# Altium project Tone Cushion.PrjPCB (part 3 of 3)
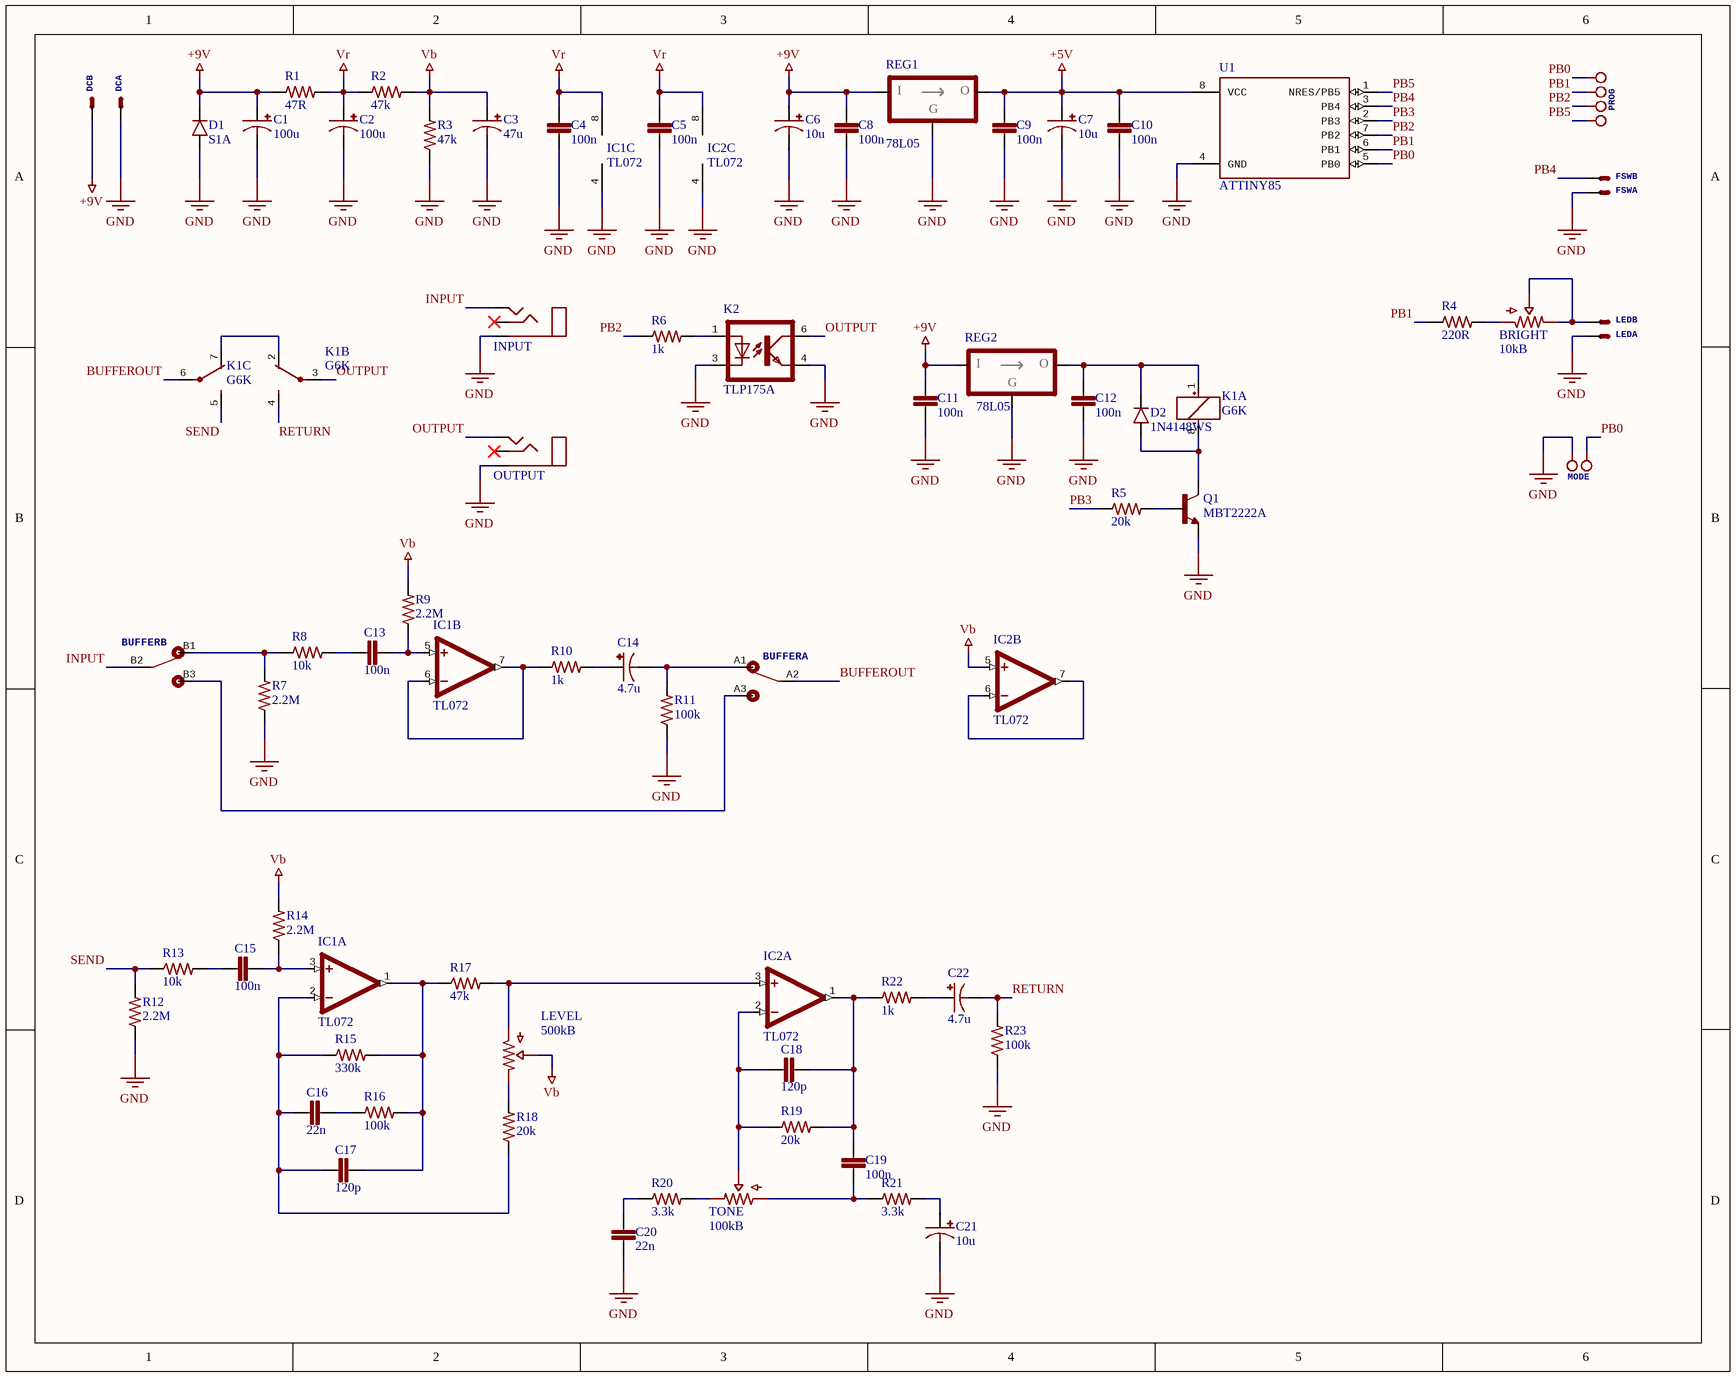
[diagram p2: Tone Cushion.SchDoc]

## Sheet Tone Cushion.SchDoc (continued)

### Library data of the parts (continued)
R7 R9 R12 R14 = CRCW06032M20FKEA: RES SMD 2.2M OHM 1% 1/10W 0603; Manufacturer: Vishay; Resistance: 2.2MR; Power Rating: 100mW; Temperature Coefficient: 100ppm/°C; Voltage Rating: 75V; Supplier 1: Farnell; Supplier Part Number 1: 2138646; Manufacturer Part Number: CRCW06032M20FKEA; Stock: 19125; Pricing: 10=0.0212, 100=0.0163, 500=0.0141, 1000=0.0073 (EUR); RoHS: Yes; Mount: Surface Mount; Case/Package: 0603; Number of Pins: 2; Weight: 7.1E-05oz; Contact Plating: Tin; Case Code (Imperial): 0603; Case Code (Metric): 1608; Min Operating Temperature: -55°C; Max Operating Temperature: 155°C; Tolerance: 1%; Packaging: Tape and Reel; Composition: Thick Film; Termination: SMD/SMT; Package Quantity: 10; Number of Terminations: 2; Military Standard: Not; Max Power Dissipation: 100mW; Voltage Rating (DC): 75V; Features: Automotive AEC-Q200; Length: 1.55mm; Height: 0.45mm; Width: 0.85mm; Depth: 0.85mm; Radiation Hardening: No; Lead Free: Lead Free; REACH SVHC: Unknown; ComponentLink1URL: https://datasheet.ciiva.com/11810/0900766b80d98afc-11810588.pdf?src-supplier=RSComponents; ComponentLink1Description: https://datasheet.ciiva.com/11810/0900766b80d98afc-11810588.pdf?src-supplier=RSComponents; ComponentLink2URL: https://datasheet.ciiva.com/2466/dcrcwe3-2466118.pdf?src-supplier=Digi-Key; ComponentLink2Description: https://datasheet.ciiva.com/2466/dcrcwe3-2466118.pdf?src-supplier=Digi-Key; ComponentLink3URL: https://datasheet.ciiva.com/22682/1912744-22682662.pdf?src-supplier=Element14; ComponentLink3Description: https://datasheet.ciiva.com/22682/1912744-22682662.pdf?src-supplier=Element14; ComponentLink4URL: https://datasheet.ciiva.com/7801/1697337-7801067.pdf?src-supplier=Element14; ComponentLink4Description: https://datasheet.ciiva.com/7801/1697337-7801067.pdf?src-supplier=Element14; ComponentLink5URL: https://datasheet.ciiva.com/22869/70201119-22869819.pdf?src-supplier=Allied+Electronics; ComponentLink5Description: https://datasheet.ciiva.com/22869/70201119-22869819.pdf?src-supplier=Allied+Electronics; ComponentLink6URL: https://datasheet.ciiva.com/26314/fld-crcw-e3-data-en-26314653.pdf?src-supplier=Distrelec; ComponentLink6Description: https://datasheet.ciiva.com/26314/fld-crcw-e3-data-en-26314653.pdf?src-supplier=Distrelec; ComponentLink7URL: https://datasheet.ciiva.com/3257/dcrcwe3-3257407.pdf?src-supplier=Avnet; ComponentLink7Description: https://datasheet.ciiva.com/3257/dcrcwe3-3257407.pdf?src-supplier=Avnet; ComponentLink8URL: https://datasheet.ciiva.com/2466/dcrcwe3-2466116.pdf?src-supplier=Digi-Key; ComponentLink8Description: https://datasheet.ciiva.com/2466/dcrcwe3-2466116.pdf?src-supplier=Digi-Key; ComponentLink9URL: https://datasheet.ciiva.com/2466/dcrcwe3-2466117.pdf?src-supplier=Digi-Key; ComponentLink9Description: https://datasheet.ciiva.com/2466/dcrcwe3-2466117.pdf?src-supplier=Digi-Key; ComponentLink10URL: https://datasheet.ciiva.com/16498/dcrcwe3-16498313.pdf?src-supplier=Future+Electronics; ComponentLink10Description: https://datasheet.ciiva.com/16498/dcrcwe3-16498313.pdf?src-supplier=Future+Electronics; ComponentLink11URL: https://datasheet.ciiva.com/7801/1697337-7801066.pdf?src-supplier=Element14; ComponentLink11Description: https://datasheet.ciiva.com/7801/1697337-7801066.pdf?src-supplier=Element14; Price: 0.0165
R8 R13 = CRCW060310K0FKEA: RES SMD 10K OHM 1% 1/10W 0603; Manufacturer: Vishay; Resistance: 10kR; Temperature Coefficient: 100ppm/°C; Power Rating: 100mW; Voltage Rating: 75V; Supplier 1: Farnell; Supplier Part Number 1: 1469748; Manufacturer Part Number: CRCW060310K0FKEA; Stock: 1391124; Pricing: 10=0.0169, 100=0.013, 500=0.0113, 1000=0.008 (EUR); RoHS: Yes; Case/Package: 0603; Number of Pins: 2; Weight: 7.1E-05oz; Contact Plating: Tin; Case Code (Metric): 1608; Case Code (Imperial): 0603; Min Operating Temperature: -55°C; Max Operating Temperature: 155°C; Tolerance: 1%; Composition: Thick Film; Packaging: Tape and Reel; Package Quantity: 10; Number of Terminations: 2; Military Standard: Not; Termination: SMD/SMT; Max Power Dissipation: 100mW; Voltage Rating (DC): 75V; Features: Automotive AEC-Q200; Length: 1.55mm; Height: 0.45mm; Width: 0.033inch; Depth: 0.85mm; Radiation Hardening: No; Lead Free: Lead Free; REACH SVHC: Unknown; ComponentLink1URL: https://datasheet.ciiva.com/11809/0900766b80d98afc-11809037.pdf?src-supplier=RSComponents; ComponentLink1Description: https://datasheet.ciiva.com/11809/0900766b80d98afc-11809037.pdf?src-supplier=RSComponents; ComponentLink2URL: https://datasheet.ciiva.com/16886/dcrcw-16886037.pdf?src-supplier=Avnet+Europe; ComponentLink2Description: https://datasheet.ciiva.com/16886/dcrcw-16886037.pdf?src-supplier=Avnet+Europe; ComponentLink3URL: https://datasheet.ciiva.com/26821/getdatasheetpartid-86831-26821109.pdf?src-supplier=Verical; ComponentLink3Description: https://datasheet.ciiva.com/26821/getdatasheetpartid-86831-26821109.pdf?src-supplier=Verical; ComponentLink4URL: https://datasheet.ciiva.com/16754/70201119-16754710.pdf?src-supplier=Allied+Electronics; ComponentLink4Description: https://datasheet.ciiva.com/16754/70201119-16754710.pdf?src-supplier=Allied+Electronics; ComponentLink5URL: https://datasheet.ciiva.com/16719/70201119-16719704.pdf?src-supplier=Allied+Electronics; ComponentLink5Description: https://datasheet.ciiva.com/16719/70201119-16719704.pdf?src-supplier=Allied+Electronics; ComponentLink6URL: https://datasheet.ciiva.com/2465/dcrcwe3-2465513.pdf?src-supplier=Digi-Key; ComponentLink6Description: https://datasheet.ciiva.com/2465/dcrcwe3-2465513.pdf?src-supplier=Digi-Key; ComponentLink7URL: https://datasheet.ciiva.com/5543/dcrcwe3-109170-5543001.pdf?src-supplier=Mouser; ComponentLink7Description: https://datasheet.ciiva.com/5543/dcrcwe3-109170-5543001.pdf?src-supplier=Mouser; ComponentLink8URL: https://datasheet.ciiva.com/2465/dcrcwe3-2465514.pdf?src-supplier=Digi-Key; ComponentLink8Description: https://datasheet.ciiva.com/2465/dcrcwe3-2465514.pdf?src-supplier=Digi-Key; ComponentLink9URL: https://datasheet.ciiva.com/46385/1697337-46385498.pdf?src-supplier=Element14; ComponentLink9Description: https://datasheet.ciiva.com/46385/1697337-46385498.pdf?src-supplier=Element14; ComponentLink10URL: https://datasheet.ciiva.com/2465/dcrcwe3-2465515.pdf?src-supplier=Digi-Key; ComponentLink10Description: https://datasheet.ciiva.com/2465/dcrcwe3-2465515.pdf?src-supplier=Digi-Key; ComponentLink11URL: https://datasheet.ciiva.com/3256/dcrcwe3-3256939.pdf?src-supplier=Avnet; ComponentLink11Description: https://datasheet.ciiva.com/3256/dcrcwe3-3256939.pdf?src-supplier=Avnet; ComponentLink12URL: https://datasheet.ciiva.com/3256/dcrcwe3-3256940.pdf?src-supplier=Avnet; ComponentLink12Description: https://datasheet.ciiva.com/3256/dcrcwe3-3256940.pdf?src-supplier=Avnet; ComponentLink13URL: https://datasheet.ciiva.com/16209/dcrcwe3-16209164.pdf?src-supplier=Future+Electronics; ComponentLink13Description: https://datasheet.ciiva.com/16209/dcrcwe3-16209164.pdf?src-supplier=Future+Electronics; ComponentLink14URL: https://datasheet.ciiva.com/26314/fld-crcw-e3-data-en-26314749.pdf?src-supplier=Distrelec; ComponentLink14Description: https://datasheet.ciiva.com/26314/fld-crcw-e3-data-en-26314749.pdf?src-supplier=Distrelec; Price: 0.0131
R11 R16 R23 = CRCW0603100KFKEA: RES SMD 100K OHM 1% 1/10W 0603; Manufacturer: Vishay; Resistance: 100kR; Temperature Coefficient: 100ppm/°C; Power Rating: 100mW; Voltage Rating: 75V; Supplier 1: Farnell; Supplier Part Number 1: 1469649; Manufacturer Part Number: CRCW0603100KFKEA; Stock: 573766; Pricing: 10=0.0169, 100=0.013, 500=0.0113, 1000=0.0068 (EUR); RoHS: Yes; Case/Package: 0603; Number of Pins: 2; Weight: 7.1E-05oz; Contact Plating: Tin; Case Code (Metric): 1608; Case Code (Imperial): 0603; Min Operating Temperature: -55°C; Max Operating Temperature: 155°C; Tolerance: 1%; Composition: Thick Film; Termination: SMD/SMT; Packaging: Tape and Reel; Package Quantity: 10; Number of Terminations: 2; Military Standard: Not; Max Power Dissipation: 100mW; Voltage Rating (DC): 75V; Features: Automotive AEC-Q200; Length: 1.55mm; Height: 0.45mm; Width: 0.033inch; Depth: 0.85mm; Radiation Hardening: No; Lead Free: Lead Free; REACH SVHC: Unknown; ComponentLink1URL: https://datasheet.ciiva.com/11809/0900766b80d98afc-11809004.pdf?src-supplier=RSComponents; ComponentLink1Description: https://datasheet.ciiva.com/11809/0900766b80d98afc-11809004.pdf?src-supplier=RSComponents; ComponentLink2URL: https://datasheet.ciiva.com/2465/dcrcwe3-2465525.pdf?src-supplier=Digi-Key; ComponentLink2Description: https://datasheet.ciiva.com/2465/dcrcwe3-2465525.pdf?src-supplier=Digi-Key; ComponentLink3URL: https://datasheet.ciiva.com/7777/1697337-7777269.pdf?src-supplier=Element14; ComponentLink3Description: https://datasheet.ciiva.com/7777/1697337-7777269.pdf?src-supplier=Element14; ComponentLink4URL: https://datasheet.ciiva.com/15159/getdatasheetpartid-93113-15159925.pdf?src-supplier=Verical; ComponentLink4Description: https://datasheet.ciiva.com/15159/getdatasheetpartid-93113-15159925.pdf?src-supplier=Verical; ComponentLink5URL: https://datasheet.ciiva.com/46441/1720486-46441605.pdf?src-supplier=Element14; ComponentLink5Description: https://datasheet.ciiva.com/46441/1720486-46441605.pdf?src-supplier=Element14; ComponentLink6URL: https://datasheet.ciiva.com/2465/dcrcwe3-2465526.pdf?src-supplier=Digi-Key; ComponentLink6Description: https://datasheet.ciiva.com/2465/dcrcwe3-2465526.pdf?src-supplier=Digi-Key; ComponentLink7URL: https://datasheet.ciiva.com/2465/dcrcwe3-2465527.pdf?src-supplier=Digi-Key; ComponentLink7Description: https://datasheet.ciiva.com/2465/dcrcwe3-2465527.pdf?src-supplier=Digi-Key; ComponentLink8URL: https://datasheet.ciiva.com/8340/dcrcwe3-8340199.pdf?src-supplier=Avnet; ComponentLink8Description: https://datasheet.ciiva.com/8340/dcrcwe3-8340199.pdf?src-supplier=Avnet; ComponentLink9URL: https://datasheet.ciiva.com/16725/70201119-16725223.pdf?src-supplier=Allied+Electronics; ComponentLink9Description: https://datasheet.ciiva.com/16725/70201119-16725223.pdf?src-supplier=Allied+Electronics; ComponentLink10URL: https://datasheet.ciiva.com/8340/dcrcwe3-8340201.pdf?src-supplier=Avnet; ComponentLink10Description: https://datasheet.ciiva.com/8340/dcrcwe3-8340201.pdf?src-supplier=Avnet; ComponentLink11URL: https://datasheet.ciiva.com/7791/66915-7791994.pdf?src-supplier=Element14; ComponentLink11Description: https://datasheet.ciiva.com/7791/66915-7791994.pdf?src-supplier=Element14; ComponentLink12URL: https://datasheet.ciiva.com/5545/dcrcwe3-109170-5545100.pdf?src-supplier=Mouser; ComponentLink12Description: https://datasheet.ciiva.com/5545/dcrcwe3-109170-5545100.pdf?src-supplier=Mouser; ComponentLink13URL: https://datasheet.ciiva.com/26317/fld-crcw-e3-data-en-26317165.pdf?src-supplier=Distrelec; ComponentLink13Description: https://datasheet.ciiva.com/26317/fld-crcw-e3-data-en-26317165.pdf?src-supplier=Distrelec; ComponentLink14URL: https://datasheet.ciiva.com/16941/dcrcw-16941311.pdf?src-supplier=Avnet+Europe; ComponentLink14Description: https://datasheet.ciiva.com/16941/dcrcw-16941311.pdf?src-supplier=Avnet+Europe; Price: 0.0136
R15 = CRCW0603330KFKEA: RES SMD 330K OHM 1% 1/10W 0603; Manufacturer: Vishay; Resistance: 330kR; Temperature Coefficient: 100ppm/°C; Power Rating: 100mW; Voltage Rating: 75V; Supplier 1: Farnell; Supplier Part Number 1: 2138547; Manufacturer Part Number: CRCW0603330KFKEA; Stock: 25517; Pricing: 10=0.0212, 100=0.0163, 500=0.0141, 1000=0.0073 (EUR); RoHS: Yes; Mount: Surface Mount; Case/Package: 0603; Number of Pins: 2; Weight: 7.1E-05oz; Contact Plating: Tin; Case Code (Imperial): 0603; Case Code (Metric): 1608; Min Operating Temperature: -55°C; Max Operating Temperature: 155°C; Composition: Thick Film; Tolerance: 1%; Packaging: Tape and Reel; Termination: SMD/SMT; Package Quantity: 10; Number of Terminations: 2; Max Power Dissipation: 100mW; Features: Automotive AEC-Q200; Military Standard: Not; Voltage Rating (DC): 75V; Working Voltage: 75V; Length: 1.55mm; Height: 0.45mm; Width: 0.85mm; Depth: 0.85mm; Radiation Hardening: No; Lead Free: Lead Free; REACH SVHC: Unknown; ComponentLink1URL: https://datasheet.ciiva.com/11810/0900766b80d98afc-11810796.pdf?src-supplier=RSComponents; ComponentLink1Description: https://datasheet.ciiva.com/11810/0900766b80d98afc-11810796.pdf?src-supplier=RSComponents; ComponentLink2URL: https://datasheet.ciiva.com/16778/70201119-16778744.pdf?src-supplier=Allied+Electronics; ComponentLink2Description: https://datasheet.ciiva.com/16778/70201119-16778744.pdf?src-supplier=Allied+Electronics; ComponentLink3URL: https://datasheet.ciiva.com/22708/1697337-22708424.pdf?src-supplier=Element14; ComponentLink3Description: https://datasheet.ciiva.com/22708/1697337-22708424.pdf?src-supplier=Element14; ComponentLink4URL: https://datasheet.ciiva.com/2465/dcrcwe3-2465930.pdf?src-supplier=Digi-Key; ComponentLink4Description: https://datasheet.ciiva.com/2465/dcrcwe3-2465930.pdf?src-supplier=Digi-Key; ComponentLink5URL: https://datasheet.ciiva.com/2465/dcrcwe3-2465931.pdf?src-supplier=Digi-Key; ComponentLink5Description: https://datasheet.ciiva.com/2465/dcrcwe3-2465931.pdf?src-supplier=Digi-Key; ComponentLink6URL: https://datasheet.ciiva.com/2465/dcrcwe3-2465932.pdf?src-supplier=Digi-Key; ComponentLink6Description: https://datasheet.ciiva.com/2465/dcrcwe3-2465932.pdf?src-supplier=Digi-Key; ComponentLink7URL: https://datasheet.ciiva.com/7792/125364-7792220.pdf?src-supplier=Element14; ComponentLink7Description: https://datasheet.ciiva.com/7792/125364-7792220.pdf?src-supplier=Element14; ComponentLink8URL: https://datasheet.ciiva.com/16203/dcrcwe3-16203007.pdf?src-supplier=Future+Electronics; ComponentLink8Description: https://datasheet.ciiva.com/16203/dcrcwe3-16203007.pdf?src-supplier=Future+Electronics; ComponentLink9URL: https://datasheet.ciiva.com/7673/1697337-7673301.pdf?src-supplier=Element14; ComponentLink9Description: https://datasheet.ciiva.com/7673/1697337-7673301.pdf?src-supplier=Element14; ComponentLink10URL: https://datasheet.ciiva.com/7673/1697337-7673302.pdf?src-supplier=Element14; ComponentLink10Description: https://datasheet.ciiva.com/7673/1697337-7673302.pdf?src-supplier=Element14; ComponentLink11URL: https://datasheet.ciiva.com/26317/fld-crcw-e3-data-en-26317177.pdf?src-supplier=Distrelec; ComponentLink11Description: https://datasheet.ciiva.com/26317/fld-crcw-e3-data-en-26317177.pdf?src-supplier=Distrelec; ComponentLink12URL: https://datasheet.ciiva.com/22870/70201119-22870764.pdf?src-supplier=Allied+Electronics; ComponentLink12Description: https://datasheet.ciiva.com/22870/70201119-22870764.pdf?src-supplier=Allied+Electronics; Price: 0.0165
R17 = CRCW060347K0FKEA: RES SMD 47K OHM 1% 1/10W 0603; Manufacturer: Vishay; Resistance: 47kR; Temperature Coefficient: 100ppm/°C; Power Rating: 100mW; Voltage Rating: 75V; Supplier 1: Farnell; Supplier Part Number 1: 1469811; Manufacturer Part Number: CRCW060347K0FKEA; Stock: 204361; Pricing: 10=0.018, 100=0.0139, 500=0.012, 1000=0.008 (EUR); RoHS: Yes; Mount: Surface Mount; Case/Package: 0603; Weight: 7.1E-05oz; Contact Plating: Tin; Case Code (Imperial): 0603; Case Code (Metric): 1608; Min Operating Temperature: -55°C; Max Operating Temperature: 155°C; Tolerance: 1%; Composition: Thick Film; Termination: SMD/SMT; Packaging: Tape and Reel; Package Quantity: 5000; Military Standard: Not; Voltage Rating (DC): 75V; Length: 1.55mm; Height: 0.45mm; Width: 0.85mm; Depth: 0.85mm; Radiation Hardening: No; Lead Free: Lead Free; REACH SVHC: Unknown; ComponentLink1URL: https://datasheet.ciiva.com/11808/0900766b80d98afc-11808694.pdf?src-supplier=RSComponents; ComponentLink1Description: https://datasheet.ciiva.com/11808/0900766b80d98afc-11808694.pdf?src-supplier=RSComponents; ComponentLink2URL: https://datasheet.ciiva.com/16763/70201119-16763141.pdf?src-supplier=Allied+Electronics; ComponentLink2Description: https://datasheet.ciiva.com/16763/70201119-16763141.pdf?src-supplier=Allied+Electronics; ComponentLink3URL: https://datasheet.ciiva.com/16893/dcrcwe3-16893430.pdf?src-supplier=Avnet+Europe; ComponentLink3Description: https://datasheet.ciiva.com/16893/dcrcwe3-16893430.pdf?src-supplier=Avnet+Europe; ComponentLink4URL: https://datasheet.ciiva.com/5548/dcrcwe3-109170-5548727.pdf?src-supplier=Mouser; ComponentLink4Description: https://datasheet.ciiva.com/5548/dcrcwe3-109170-5548727.pdf?src-supplier=Mouser; ComponentLink5URL: https://datasheet.ciiva.com/3257/dcrcwe3-3257631.pdf?src-supplier=Avnet; ComponentLink5Description: https://datasheet.ciiva.com/3257/dcrcwe3-3257631.pdf?src-supplier=Avnet; ComponentLink6URL: https://datasheet.ciiva.com/16286/dcrcwe3-16286447.pdf?src-supplier=Future+Electronics; ComponentLink6Description: https://datasheet.ciiva.com/16286/dcrcwe3-16286447.pdf?src-supplier=Future+Electronics; ComponentLink7URL: https://datasheet.ciiva.com/7777/1720486-7777607.pdf?src-supplier=Element14; ComponentLink7Description: https://datasheet.ciiva.com/7777/1720486-7777607.pdf?src-supplier=Element14; ComponentLink8URL: https://datasheet.ciiva.com/7777/125364-7777562.pdf?src-supplier=Element14; ComponentLink8Description: https://datasheet.ciiva.com/7777/125364-7777562.pdf?src-supplier=Element14; Price: 0.0131
R20 R21 = CRCW06033K30FKEA: RES SMD 3.3K OHM 1% 1/10W 0603; Manufacturer: Vishay; Resistance: 3.3kR; Temperature Coefficient: 100ppm/°C; Power Rating: 100mW; Voltage Rating: 75V; Supplier 1: Farnell; Supplier Part Number 1: 1469793; Manufacturer Part Number: CRCW06033K30FKEA; Stock: 173901; Pricing: 10=0.0171, 100=0.0132, 500=0.0114, 1000=0.0068 (EUR); RoHS: Yes; Mount: Surface Mount; Case/Package: 0603; Weight: 7.1E-05oz; Contact Plating: Tin; Case Code (Imperial): 0603; Case Code (Metric): 1608; Min Operating Temperature: -55°C; Max Operating Temperature: 155°C; Tolerance: 1%; Composition: Thick Film; Packaging: Tape and Reel; Package Quantity: 10; Number of Terminations: 2; Termination: SMD/SMT; Military Standard: Not; Max Power Dissipation: 100mW; Voltage Rating (DC): 75V; Features: Automotive AEC-Q200; Working Voltage: 75V; Length: 1.55mm; Height: 0.45mm; Width: 0.85mm; Depth: 0.85mm; Radiation Hardening: No; REACH SVHC: Unknown; Lead Free: Lead Free; ComponentLink1URL: https://datasheet.ciiva.com/11808/0900766b80d98afc-11808705.pdf?src-supplier=RSComponents; ComponentLink1Description: https://datasheet.ciiva.com/11808/0900766b80d98afc-11808705.pdf?src-supplier=RSComponents; ComponentLink2URL: https://datasheet.ciiva.com/26314/fld-crcw-e3-data-en-26314711.pdf?src-supplier=Distrelec; ComponentLink2Description: https://datasheet.ciiva.com/26314/fld-crcw-e3-data-en-26314711.pdf?src-supplier=Distrelec; ComponentLink3URL: https://datasheet.ciiva.com/7672/1720486-7672906.pdf?src-supplier=Element14; ComponentLink3Description: https://datasheet.ciiva.com/7672/1720486-7672906.pdf?src-supplier=Element14; ComponentLink4URL: https://datasheet.ciiva.com/7673/1720486-7673146.pdf?src-supplier=Element14; ComponentLink4Description: https://datasheet.ciiva.com/7673/1720486-7673146.pdf?src-supplier=Element14; ComponentLink5URL: https://datasheet.ciiva.com/16200/dcrcwe3-16200585.pdf?src-supplier=Future+Electronics; ComponentLink5Description: https://datasheet.ciiva.com/16200/dcrcwe3-16200585.pdf?src-supplier=Future+Electronics; ComponentLink6URL: https://datasheet.ciiva.com/16893/dcrcw-16893324.pdf?src-supplier=Avnet+Europe; ComponentLink6Description: https://datasheet.ciiva.com/16893/dcrcw-16893324.pdf?src-supplier=Avnet+Europe; Price: 0.0131
REG1 REG2 = TS78L05CXRFG: TAIWAN SEMICONDUCTOR - TS78L05CX RFG - REG 3-TERMINAL 100MA, SMD, SOT23-3; Min Input Voltage: 0uV; Max Input Voltage: 35V; Number of Outputs: 1; Nominal Output Voltage: 5V; Supplier 1: Farnell; Supplier Part Number 1: 1476698; Manufacturer: Taiwan Semiconductor; Manufacturer Part Number: TS78L05CXRFG; Stock: 0; Pricing: 5=0.101, 50=0.099, 100=0.097, 250=0.0949, 500=0.0929, 1000=0.0909, 5000=0.0889, 10000=0.0869 (EUR); RoHS: Yes; Case/Package: SOT-23; Number of Pins: 3; Min Operating Temperature: 0°C; Max Operating Temperature: 125°C; Output Current: 100mA; Packaging: Cut Tape; REACH SVHC: No SVHC; ComponentLink1URL: http://www.farnell.com/datasheets/2044138.pdf?src-supplier=Farnell; ComponentLink1Description: http://www.farnell.com/datasheets/2044138.pdf?src-supplier=Farnell; ComponentLink2URL: http://www.farnell.com/datasheets/4546.pdf?src-supplier=Element14; ComponentLink2Description: http://www.farnell.com/datasheets/4546.pdf?src-supplier=Element14; ComponentLink3URL: http://www.taiwansemi.com/products/datasheet/TS78L00_I15.pdf?src-supplier=Digi-Key; ComponentLink3Description: http://www.taiwansemi.com/products/datasheet/TS78L00_I15.pdf?src-supplier=Digi-Key; Price: 0.262
TONE = POT_100kB_ALPHA_16mm: 100k Lin potentiometer round shaft; Price: 0.5; Dimensions: 16mm; Package: PCB Mounted
U1 = ATTINY85-20SU: IC, 8BIT MCU, AVR TINY, 20MHZ, 8-SOIC; Manufacturer: Microchip / Atmel; Memory Type: FLASH; Memory Size: 8KB; Number of Timers/Counters: 2; RAM Size: 512B; Interface: SPI; Max Supply Voltage: 5.5V; Min Supply Voltage: 2.7V; Number of I/Os: 6; Oscillator Type: Internal; Peripherals: Brown-out Detect/Reset; Data Bus Width: 8b; Watchdog Timer: Yes; Number of ADC Channels: 4; Number of UART Channels: 1; Access Time: 20us; Supplier 1: Farnell; Supplier Part Number 1: 1455164; Manufacturer Part Number: ATTINY85-20SU; Stock: 2172; Pricing: 1=0.972, 25=0.925, 100=0.894, 1000=0.862 (EUR); RoHS: Yes; Mount: Surface Mount; Case/Package: SOIC; Number of Pins: 8; Contact Plating: Tin; Min Operating Temperature: -40°C; Max Operating Temperature: 85°C; Frequency: 20MHz; Packaging: Rail/Tube; Core Architecture: AVR; Package Quantity: 95; Number of Programmable I/O: 6; Max Frequency: 20MHz; Number of PWM Channels: 6; Density: 8KB; Number of SPI Channels: 1; Number of I2C Channels: 1; Termination: SMD/SMT; Length: 5.35mm; Height: 1.91mm; Width: 5.4mm; Radiation Hardening: No; Lead Free: Lead Free; REACH SVHC: No SVHC; ComponentLink1URL: https://datasheet.ciiva.com/1167/1698186-1167152.pdf?src-supplier=Newark; ComponentLink1Description: https://datasheet.ciiva.com/1167/1698186-1167152.pdf?src-supplier=Newark; ComponentLink2URL: https://datasheet.ciiva.com/15122/getdatasheetpartid-131914-15122511.pdf?src-supplier=Verical; ComponentLink2Description: https://datasheet.ciiva.com/15122/getdatasheetpartid-131914-15122511.pdf?src-supplier=Verical; ComponentLink3URL: https://datasheet.ciiva.com/26207/doc2586-26207573.pdf?src-supplier=Avnet+Europe; ComponentLink3Description: https://datasheet.ciiva.com/26207/doc2586-26207573.pdf?src-supplier=Avnet+Europe; ComponentLink4URL: https://datasheet.ciiva.com/28653/1698186-28653829.pdf?src-supplier=Element14; ComponentLink4Description: https://datasheet.ciiva.com/28653/1698186-28653829.pdf?src-supplier=Element14; ComponentLink5URL: https://datasheet.ciiva.com/3203/doc2586-3203150.pdf?src-supplier=Avnet; ComponentLink5Description: https://datasheet.ciiva.com/3203/doc2586-3203150.pdf?src-supplier=Avnet; Price: 0.98

### Notes on the sheet
- (in symbol TS78L05CXRFG) I; O; G